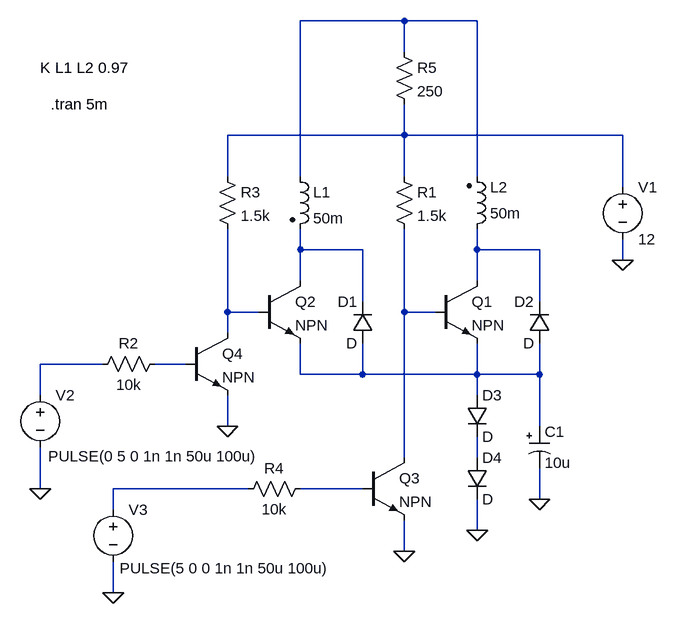
[diagram p0: schematic Draft21.asc]
Draft21.asc, the LTspice schematic file:
Version 4
SHEET 1 880 832
WIRE 480 -64 320 -64
WIRE 592 -64 480 -64
WIRE 480 -16 480 -64
WIRE 480 112 480 64
WIRE 480 112 208 112
WIRE 816 112 480 112
WIRE 208 176 208 112
WIRE 320 176 320 -64
WIRE 480 176 480 112
WIRE 592 176 592 -64
WIRE 816 192 816 112
WIRE 320 288 320 256
WIRE 416 288 320 288
WIRE 592 288 592 256
WIRE 688 288 592 288
WIRE 816 304 816 272
WIRE 320 336 320 288
WIRE 592 336 592 288
WIRE 416 368 416 288
WIRE 688 368 688 288
WIRE 208 384 208 256
WIRE 256 384 208 384
WIRE 480 384 480 256
WIRE 528 384 480 384
WIRE 208 416 208 384
WIRE 16 464 -80 464
WIRE 144 464 96 464
WIRE 320 480 320 432
WIRE 416 480 416 432
WIRE 416 480 320 480
WIRE 592 480 592 432
WIRE 592 480 416 480
WIRE 688 480 688 432
WIRE 688 480 592 480
WIRE -80 512 -80 464
WIRE 592 512 592 480
WIRE 208 560 208 512
WIRE 688 560 688 480
WIRE 480 608 480 384
WIRE 592 608 592 576
WIRE -80 656 -80 592
WIRE 240 656 32 656
WIRE 416 656 320 656
WIRE 688 672 688 624
WIRE 32 688 32 656
WIRE 592 720 592 672
WIRE 480 752 480 704
WIRE 32 816 32 768
FLAG 816 304 0
FLAG -80 656 0
FLAG 32 816 0
FLAG 592 720 0
FLAG 480 752 0
FLAG 208 560 0
FLAG 688 672 0
SYMBOL npn 528 336 R0
SYMATTR InstName Q1
SYMBOL ind2 304 160 R0
SYMATTR InstName L1
SYMATTR Value 50m
SYMATTR Type ind
SYMATTR SpiceLine Rpar=310
SYMBOL voltage 816 176 R0
SYMATTR InstName V1
SYMATTR Value 12
SYMBOL voltage -80 496 R0
WINDOW 3 12 110 Left 2
SYMATTR InstName V2
SYMATTR Value PULSE(0 5 0 1n 1n 50u 100u)
SYMBOL diode 432 432 R180
WINDOW 0 24 64 Left 2
WINDOW 3 24 0 Left 2
SYMATTR InstName D1
SYMBOL npn 256 336 R0
SYMATTR InstName Q2
SYMBOL ind2 576 272 M180
WINDOW 0 36 80 Left 2
WINDOW 3 36 40 Left 2
SYMATTR InstName L2
SYMATTR Value 50m
SYMATTR Type ind
SYMATTR SpiceLine Rpar=310
SYMBOL diode 704 432 R180
WINDOW 0 24 64 Left 2
WINDOW 3 24 0 Left 2
SYMATTR InstName D2
SYMBOL voltage 32 672 R0
WINDOW 3 10 106 Left 2
SYMATTR InstName V3
SYMATTR Value PULSE(5 0 0 1n 1n 50u 100u)
SYMBOL diode 576 512 R0
SYMATTR InstName D3
SYMBOL diode 576 608 R0
SYMATTR InstName D4
SYMBOL polcap 672 560 R0
SYMATTR InstName C1
SYMATTR Value 10u
SYMBOL res 464 160 R0
SYMATTR InstName R1
SYMATTR Value 1.5k
SYMBOL res 192 160 R0
SYMATTR InstName R3
SYMATTR Value 1.5k
SYMBOL npn 416 608 R0
SYMATTR InstName Q3
SYMBOL npn 144 416 R0
SYMATTR InstName Q4
SYMBOL res 112 448 R90
WINDOW 0 0 56 VBottom 2
WINDOW 3 32 56 VTop 2
SYMATTR InstName R2
SYMATTR Value 10k
SYMBOL res 336 640 R90
WINDOW 0 0 56 VBottom 2
WINDOW 3 32 56 VTop 2
SYMATTR InstName R4
SYMATTR Value 10k
SYMBOL res 464 -32 R0
SYMATTR InstName R5
SYMATTR Value 250
TEXT -64 64 Left 2 !.tran 5m
TEXT -80 8 Left 2 !K L1 L2 0.97

The netlist it stands for:
* Draft21.asc
Q1 N004 N006 N009 0 NPN
L1 N001 N003 50m Rpar=310
V1 N002 0 12
V2 N007 0 PULSE(0 5 0 1n 1n 50u 100u)
D1 N009 N003 D
Q2 N003 N005 N009 0 NPN
L2 N004 N001 50m Rpar=310
D2 N009 N004 D
V3 N011 0 PULSE(5 0 0 1n 1n 50u 100u)
D3 N009 N010 D
D4 N010 0 D
C1 N009 0 10u
R1 N002 N006 1.5k
R3 N002 N005 1.5k
Q3 N006 N012 0 0 NPN
Q4 N005 N008 0 0 NPN
R2 N008 N007 10k
R4 N012 N011 10k
R5 N001 N002 250
.model D D
.lib standard.dio
.model NPN NPN
.model PNP PNP
.lib standard.bjt
.tran 5m
K L1 L2 0.97
.backanno
.end